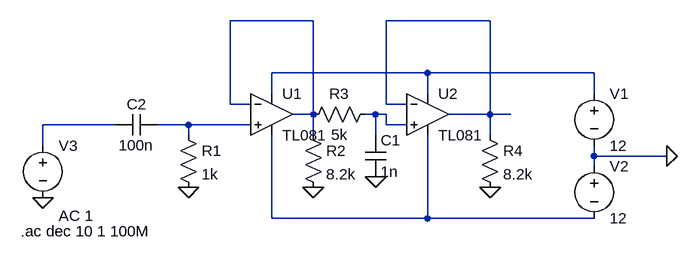
[diagram p0: schematic p1e1.asc]
p1e1.asc, the LTspice schematic file:
Version 4
SHEET 1 880 680
WIRE 176 0 48 0
WIRE 448 0 288 0
WIRE 352 80 112 80
WIRE 608 80 352 80
WIRE 112 112 112 80
WIRE 352 112 352 80
WIRE 608 112 608 80
WIRE 48 128 48 0
WIRE 80 128 48 128
WIRE 288 128 288 0
WIRE 320 128 288 128
WIRE 176 144 176 0
WIRE 176 144 144 144
WIRE 272 144 256 144
WIRE 288 144 272 144
WIRE 448 144 448 0
WIRE 448 144 384 144
WIRE 480 144 448 144
WIRE -128 160 -240 160
WIRE -16 160 -64 160
WIRE 80 160 -16 160
WIRE 288 160 288 144
WIRE 320 160 288 160
WIRE -16 176 -16 160
WIRE 176 176 176 144
WIRE 272 176 272 144
WIRE 448 176 448 144
WIRE -240 192 -240 160
WIRE 608 208 608 192
WIRE 720 208 608 208
WIRE 608 224 608 208
WIRE 112 304 112 176
WIRE 352 304 352 176
WIRE 352 304 112 304
WIRE 608 304 352 304
FLAG 720 208 0
FLAG 448 256 0
FLAG -16 256 0
FLAG 176 256 0
FLAG 272 240 0
FLAG -240 272 0
SYMBOL AutoGenerated\\TL081 112 144 R0
SYMATTR InstName U1
SYMBOL AutoGenerated\\TL081 352 144 R0
SYMATTR InstName U2
SYMBOL voltage 608 96 R0
WINDOW 123 0 0 Left 0
WINDOW 39 0 0 Left 0
SYMATTR InstName V1
SYMATTR Value 12
SYMBOL voltage 608 208 R0
WINDOW 123 0 0 Left 0
WINDOW 39 0 0 Left 0
SYMATTR InstName V2
SYMATTR Value 12
SYMBOL res -32 160 R0
SYMATTR InstName R1
SYMATTR Value 1k
SYMBOL res 160 160 R0
SYMATTR InstName R2
SYMATTR Value 8.2k
SYMBOL res 272 128 R90
WINDOW 0 0 56 VBottom 2
WINDOW 3 32 56 VTop 2
SYMATTR InstName R3
SYMATTR Value 5k
SYMBOL cap 256 176 R0
SYMATTR InstName C1
SYMATTR Value 1n
SYMBOL cap -64 144 R90
WINDOW 0 0 32 VBottom 2
WINDOW 3 32 32 VTop 2
SYMATTR InstName C2
SYMATTR Value 100n
SYMBOL res 432 160 R0
SYMATTR InstName R4
SYMATTR Value 8.2k
SYMBOL voltage -240 176 R0
WINDOW 123 24 124 Left 2
WINDOW 39 0 0 Left 0
SYMATTR InstName V3
SYMATTR Value ""
SYMATTR Value2 AC 1
TEXT -274 324 Left 2 !.ac dec 10 1 100M

The netlist it stands for:
* p1e1.asc
* U1: TL081 (symbol AutoGenerated\TL081 not available, pins judged from their places): In+=N006 In-=N001 V+=N003 V-=N007 OUT=N001
* U2: TL081 (symbol AutoGenerated\TL081 not available, pins judged from their places): In+=N004 In-=N002 V+=N003 V-=N007 OUT=N002
V1 N003 0 12
V2 0 N007 12
R1 N006 0 1k
R2 N001 0 8.2k
R3 N004 N001 5k
C1 N004 0 1n
C2 N006 N005 100n
R4 N002 0 8.2k
V3 N005 0 AC 1
.ac dec 10 1 100M
.backanno
.end